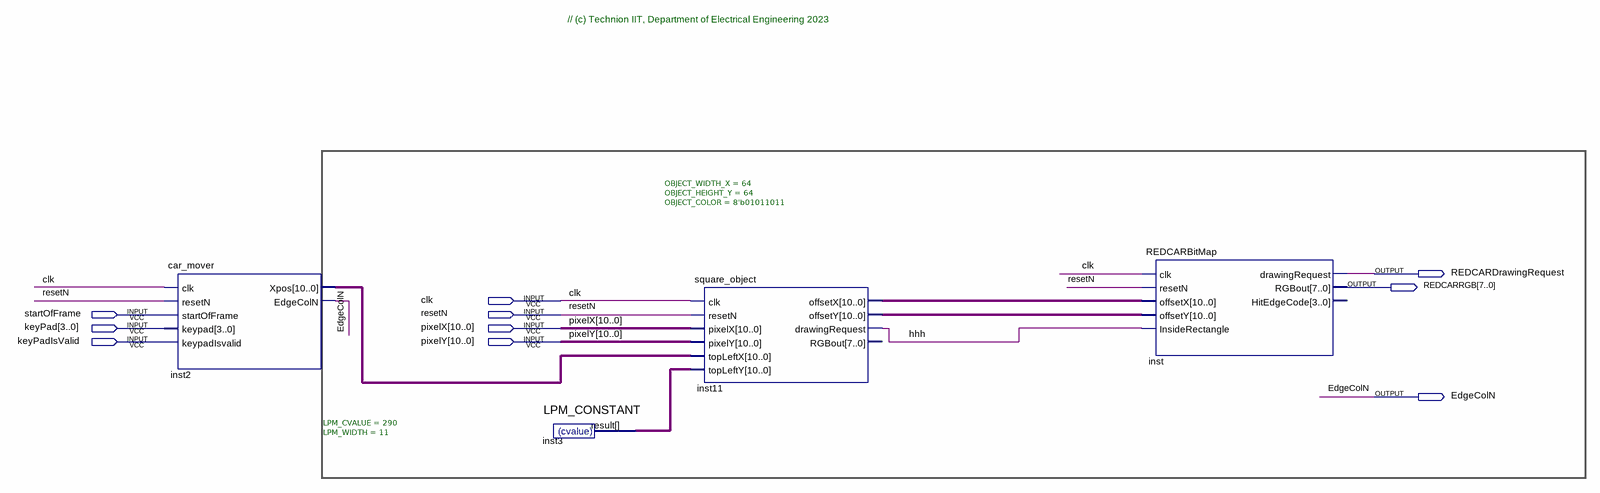
[diagram p0: schematic sheet]
// Quartus schematic RED_CAR_DISPLAY.bdf as structural Verilog: 4 symbols, 10 pins
module RED_CAR_DISPLAY (
  input  clk,
  input  startOfFrame,
  input  resetN,
  input  [3:0] keyPad,
  input  [10:0] pixelX,
  input  keyPadIsValid,
  input  [10:0] pixelY,
  output REDCARDrawingRequest,
  output [7:0] REDCARRGB,
  output EdgeColN
);

  wire hhh;
  wire [10:0] inst2_xpos, inst3_result, inst11_offsetx, inst11_offsety;

  car_mover inst2 (
    .clk(clk), .resetN(resetN), .startOfFrame(startOfFrame), .keypad(keyPad), .keypadIsvalid(keyPadIsValid),
    .Xpos(inst2_xpos), .EdgeColN(EdgeColN));
  LPM_CONSTANT #(.LPM_CVALUE(290), .LPM_WIDTH(11)) inst3 (.result(inst3_result));
  square_object #(.OBJECT_WIDTH_X(64), .OBJECT_HEIGHT_Y(64), .OBJECT_COLOR(8'b01011011)) inst11 (
    .clk(clk), .resetN(resetN), .pixelX(pixelX), .pixelY(pixelY), .topLeftX(inst2_xpos),
    .topLeftY(inst3_result), .offsetX(inst11_offsetx), .offsetY(inst11_offsety), .drawingRequest(hhh));  // open: RGBout
  REDCARBitMap inst (
    .clk(clk), .resetN(resetN), .offsetX(inst11_offsetx), .offsetY(inst11_offsety), .InsideRectangle(hhh),
    .drawingRequest(REDCARDrawingRequest), .RGBout(REDCARRGB));  // open: HitEdgeCode

  // Notes on the sheet:
  //   // (c) Technion IIT, Department of Electrical Engineering 2023
endmodule
